# Altium schematic sheet Single-ADC_ADS1252U.SchDoc
size A4; SheetNumber: 6; SheetTotal: 8
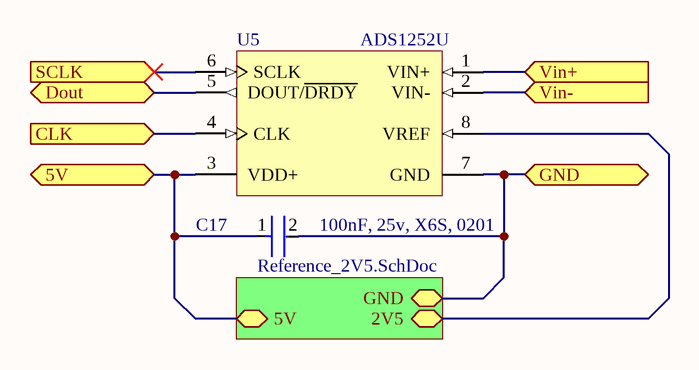
[diagram p0: Single-ADC_ADS1252U.SchDoc]

## Parts
C17  100nF, 25v, X6S, 0201  [FP-GRM033-0_03-IPC_B]
U5  ADS1252U  [TI-D8_M]

## Sub-sheets
Vref-2v5 = Reference_2V5.SchDoc: 2V5 (bidir), 5V (bidir), GND (bidir)

## Ports
5V (bidir, see CellVoltageControl[4B], Reference_2V5[1B]), CLK (in, see CellVoltageControl[4B]), Dout (bidir, see CellVoltageControl[4B]), GND (bidir, see CellVoltageControl[4B], Reference_2V5[3B]), SCLK (in), Vin+ (in, see CellVoltageControl[4B]), Vin- (in, see CellVoltageControl[4B])

## Nets
5V: C17.1 U5.3(VDD+) ; port 5V, sheet Vref-2v5/5V
CLK: U5.4(CLK) ; port CLK
Dout: U5.5(DOUT/~{DRDY}) ; port Dout
GND: C17.2 U5.7(GND) ; port GND, sheet Vref-2v5/GND
SCLK: U5.6(SCLK) ; port SCLK
Vin+: U5.1(VIN+) ; port Vin+
Vin-: U5.2(VIN-) ; port Vin-
NetU5_8: U5.8(VREF) ; sheet Vref-2v5/2V5

## Library data of the parts
C17 = CMP-06035-023320-1: Chip Multilayer Ceramic Capacitors for General Purpose, 0201, 0.10uF, X6S, 22%, 10%, 25V; Height: 0.3mm; Width: 0.3mm; Weight: 1.2E-05oz; Min Operating Temperature: -55°C; Dielectric: X6S; Packaging: Tape and Reel; Tolerance: 10%; Mount: Surface Mount; Case Code (Imperial): 0201; Case/Package: 0201; Max Operating Temperature: 105°C; Case Code (Metric): 0603; Voltage Rating: 25V; Capacitance: 100nF; Package Quantity: 15000; Thickness: 0.013inch; Length: 0.024inch; Termination: SMD/SMT; Voltage Rating (DC): 25V
U5 = CMP-0003-00072-2: ResolutionPlus 24-Bit, 40 kHz ADC, -40 to 85 degC, 8-pin SOIC (D8), Green (RoHS & no Sb/Br); Manufacturer: Texas Instruments; Analog Voltage AV/DD(Max)(V): 5.25; # Input Channels: 1; Architecture: Delta-Sigma; Sample Rate (max)(SPS): 41k; Digital Supply(Min)(V): 4.75; Resolution(Bits): 24; Interface: Serial SPI; SubFamily: Precision ADC (<=10MSPS); ComponentLink1URL: http://www.ti.com/; Code_JEDEC: MS-012; ComponentLink3Description: Package Specification; PackageVersion: 4040047-3/M, 06/2011; PackageReference: D8; ComponentLink2URL: http://www.ti.com/general/docs/lit/getliterature.tsp?genericPartNumber=ADS1252&fileType=pdf; INL(Max)(+/-LSB): 1; DatasheetVersion: SBAS127D; ComponentLink3URL: http://www.ti.com/litv/pdf/msoi002j; Mounting Technology: Surface Mount; ComponentLink1Description: Manufacturer URL; PackageDescription: 8-Pin Plastic Small Outline, Body 4.9 x 3.9 mm, Pitch 1.27 mm; PartNumber: ADS1252U; Analog Voltage AV/DD(Min)(V): 4.75; ComponentLink2Description: Datasheet; Eco-Plan: Green (RoHS & no Sb/Br); Digital Supply(Max)(V): 5.25